# Altium schematic sheet psu.SchDoc
size A4; SheetNumber: 1; SheetTotal: 2
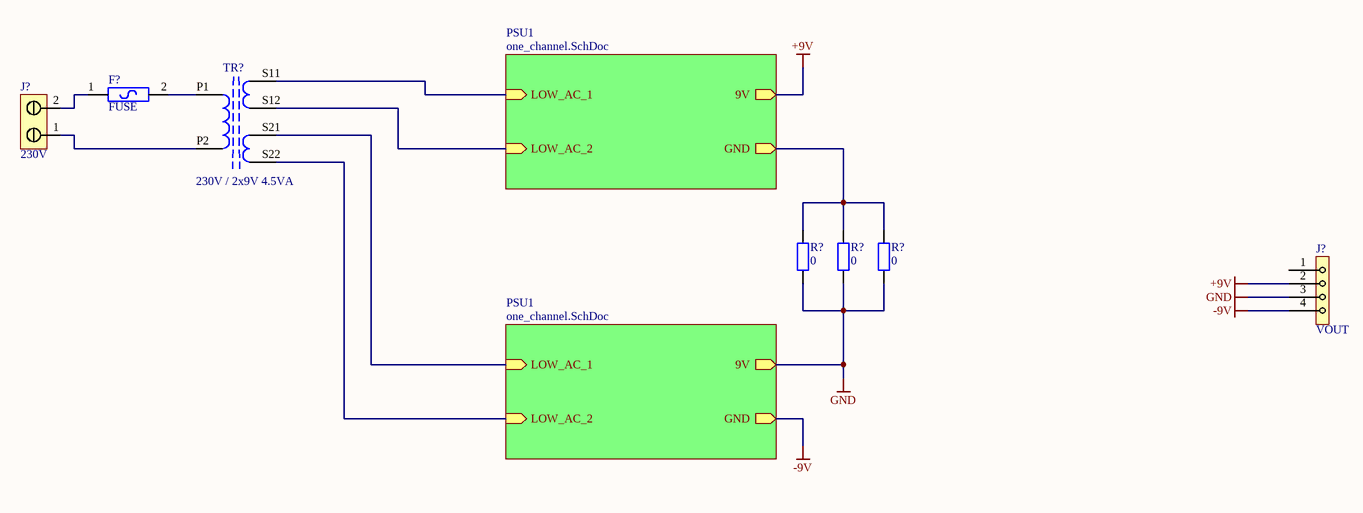
[diagram p0: psu.SchDoc]

## Parts
(Parts that share a designator on the sheet are numbered #1, #2 ... from top to bottom, then left to right.)
F?  FUSE
J?#1  230V  [KFS-5.0-2P-I]
J?#2  VOUT  [PIN_HEADER_1L_4P]
R?#1  Resistance: 0  (hidden comment: Resistor)
R?#2  Resistance: 0  (hidden comment: Resistor)
R?#3  Resistance: 0  (hidden comment: Resistor)
TR?  230V / 2x9V 4.5VA  [TRANSFORMER_1P_2S_MAKRAI]

## Sub-sheets
PSU1 = one_channel.SchDoc: LOW_AC_2 (in), LOW_AC_1 (in), 9V (out), GND (out)
PSU1 = one_channel.SchDoc: LOW_AC_2 (in), LOW_AC_1 (in), 9V (out), GND (out)

## Nets
+9V: J?#2.2 ; sheet PSU1/9V
-9V: J?#2.4 ; sheet PSU1/GND
GND: J?#2.3 R?#1.2 R?#2.2 R?#3.2 ; sheet PSU1/9V
NetF?_1: F?.1 J?#1.2
NetF?_2: F?.2 TR?.P1
NetJ?#1_1: J?#1.1 TR?.P2
NetR?#1_1: R?#1.1 R?#2.1 R?#3.1 ; sheet PSU1/GND
NetTR?_S11: TR?.S11 ; sheet PSU1/LOW_AC_1
NetTR?_S12: TR?.S12 ; sheet PSU1/LOW_AC_2
NetTR?_S21: TR?.S21(S3) ; sheet PSU1/LOW_AC_1
NetTR?_S22: TR?.S22 ; sheet PSU1/LOW_AC_2

Not connected (* = marked no-connect by the designer): J?#2 1

## Library data of the parts
J?#1 = KFS-5.0-2P-I: Sorkapocs, 90 fokos, 5mm, Pólusok száma: 2, 0.5...2.5mm2
J?#2 = PIN_HEADER_1L_4P
R?#1-R?#3 = Resistor: EU symbol
TR? = Transformer_2